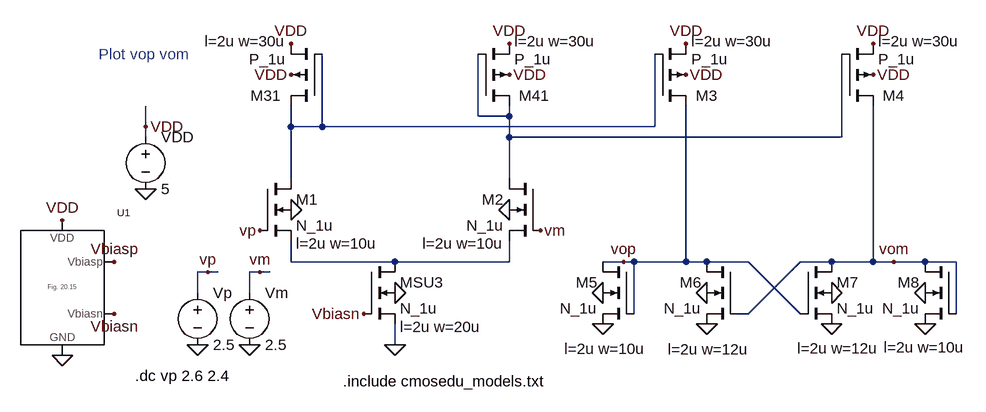
[diagram p0: schematic Fig27_7b.asc]
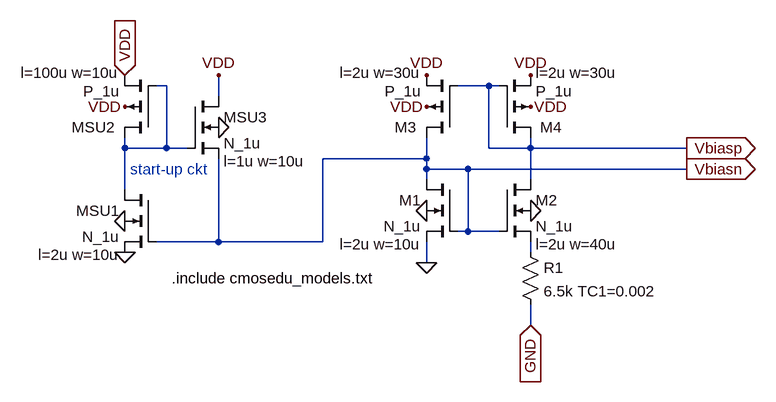
[diagram p1: sub-circuit fig_20_15.asc]
Fig27_7b.asc, the LTspice schematic file:
Version 4
SHEET 1 1928 680
WIRE 928 -80 928 -176
WIRE 976 -80 976 -96
WIRE 976 -80 928 -80
WIRE 416 -64 416 -96
WIRE 640 -64 640 -96
WIRE 688 -64 688 -176
WIRE 688 -64 640 -64
WIRE 1200 -64 1200 -176
WIRE 1200 -64 688 -64
WIRE 416 -48 416 -64
WIRE 976 -48 976 -80
WIRE 1488 -48 1488 -176
WIRE 1488 -48 976 -48
WIRE 640 16 640 -64
WIRE 976 16 976 -48
WIRE 640 144 640 112
WIRE 800 144 640 144
WIRE 976 144 976 112
WIRE 976 144 800 144
WIRE 1152 144 1120 144
WIRE 1168 144 1152 144
WIRE 1248 144 1248 -96
WIRE 1248 144 1168 144
WIRE 1280 144 1248 144
WIRE 1344 144 1280 144
WIRE 1472 144 1424 144
WIRE 1536 144 1536 -96
WIRE 1536 144 1472 144
WIRE 1568 144 1536 144
WIRE 1616 144 1568 144
WIRE 1664 144 1616 144
WIRE 512 160 496 160
WIRE 528 160 512 160
WIRE 592 160 576 160
WIRE 608 160 592 160
WIRE 496 192 496 160
WIRE 576 192 576 160
WIRE 1168 224 1168 144
WIRE 1344 224 1424 144
WIRE 1344 224 1328 224
WIRE 1424 224 1344 144
WIRE 1664 224 1664 144
WIRE 800 272 800 240
FLAG 416 32 0
FLAG 416 -64 VDD
FLAG 800 192 0
FLAG 640 -144 VDD
FLAG 976 -144 VDD
FLAG 288 80 VDD
FLAG 288 288 0
FLAG 368 144 Vbiasp
FLAG 368 224 Vbiasn
FLAG 800 272 0
FLAG 752 224 Vbiasn
FLAG 640 -192 VDD
FLAG 976 -192 VDD
FLAG 640 64 0
FLAG 976 64 0
FLAG 592 96 vp
FLAG 1024 96 vm
FLAG 496 272 0
FLAG 512 160 vp
FLAG 576 272 0
FLAG 592 160 vm
FLAG 1248 -144 VDD
FLAG 1248 -192 VDD
FLAG 1536 -144 VDD
FLAG 1536 -192 VDD
FLAG 1120 192 0
FLAG 1280 192 0
FLAG 1472 192 0
FLAG 1616 192 0
FLAG 1120 240 0
FLAG 1280 240 0
FLAG 1472 240 0
FLAG 1616 240 0
FLAG 1152 144 vop
FLAG 1568 144 vom
SYMBOL voltage 416 -64 R0
SYMATTR InstName VDD
SYMATTR Value 5
SYMBOL nmos4 752 144 R0
WINDOW 123 56 100 Left 2
SYMATTR Value2 l=2u w=20u
SYMATTR InstName MSU3
SYMATTR Value N_1u
SYMBOL pmos4 688 -96 R180
WINDOW 0 63 16 Left 2
WINDOW 123 56 100 Left 2
SYMATTR InstName M31
SYMATTR Value2 l=2u w=30u
SYMATTR Value P_1u
SYMBOL pmos4 928 -96 M180
WINDOW 0 63 16 Left 2
WINDOW 123 56 100 Left 2
SYMATTR InstName M41
SYMATTR Value2 l=2u w=30u
SYMATTR Value P_1u
SYMBOL nmos4 1024 16 M0
WINDOW 123 56 100 Left 2
SYMATTR Value2 l=2u w=10u
SYMATTR InstName M2
SYMATTR Value N_1u
SYMBOL nmos4 592 16 R0
WINDOW 123 56 100 Left 2
SYMATTR Value2 l=2u w=10u
SYMATTR InstName M1
SYMATTR Value N_1u
SYMBOL Fig_20_15 224 192 R0
SYMATTR InstName U1
SYMBOL voltage 496 176 R0
SYMATTR InstName Vp
SYMATTR Value 2.5
SYMBOL voltage 576 176 R0
SYMATTR InstName Vm
SYMATTR Value 2.5
SYMBOL pmos4 1200 -96 M180
WINDOW 0 63 16 Left 2
WINDOW 123 56 100 Left 2
SYMATTR InstName M3
SYMATTR Value2 l=2u w=30u
SYMATTR Value P_1u
SYMBOL pmos4 1488 -96 M180
WINDOW 0 63 16 Left 2
WINDOW 123 56 100 Left 2
SYMATTR InstName M4
SYMATTR Value2 l=2u w=30u
SYMATTR Value P_1u
SYMBOL nmos4 1168 144 M0
WINDOW 123 -18 134 Left 2
SYMATTR Value2 l=2u w=10u
SYMATTR InstName M5
SYMATTR Value N_1u
SYMBOL nmos4 1328 144 M0
WINDOW 123 -17 135 Left 2
SYMATTR Value2 l=2u w=12u
SYMATTR InstName M6
SYMATTR Value N_1u
SYMBOL nmos4 1424 144 R0
WINDOW 123 -5 133 Left 2
SYMATTR Value2 l=2u w=12u
SYMATTR InstName M7
SYMATTR Value N_1u
SYMBOL nmos4 1664 144 M0
WINDOW 123 -14 132 Left 2
SYMATTR Value2 l=2u w=10u
SYMATTR InstName M8
SYMATTR Value N_1u
TEXT 720 328 Left 2 !.include cmosedu_models.txt
TEXT 344 -176 Left 2 ;Plot vop vom
TEXT 400 320 Left 2 !.dc vp 2.6 2.4

fig_20_15.asc, the sub-circuit schematic file:
Version 4
SHEET 1 1556 680
WIRE 608 -80 592 -80
WIRE 1104 -80 1056 -80
WIRE 1120 -80 1104 -80
WIRE 688 -64 688 -96
WIRE 544 16 544 0
WIRE 608 16 608 -80
WIRE 608 16 544 16
WIRE 640 16 608 16
WIRE 1104 16 1104 -80
WIRE 1168 16 1168 0
WIRE 1168 16 1104 16
WIRE 1408 16 1168 16
WIRE 1008 32 1008 0
WIRE 1008 32 848 32
WIRE 1008 48 1008 32
WIRE 1072 48 1008 48
WIRE 1408 48 1072 48
WIRE 1008 64 1008 48
WIRE 1168 64 1168 16
WIRE 544 80 544 16
WIRE 1072 144 1072 48
WIRE 1072 144 1056 144
WIRE 1120 144 1072 144
WIRE 688 160 688 32
WIRE 688 160 592 160
WIRE 848 160 848 32
WIRE 848 160 688 160
WIRE 1168 176 1168 160
WIRE 1008 192 1008 160
WIRE 1168 288 1168 256
FLAG 544 -48 VDD
FLAG 544 128 0
FLAG 688 -16 0
FLAG 688 -96 VDD
FLAG 1008 -48 VDD
FLAG 1008 -96 VDD
FLAG 1168 -48 VDD
FLAG 1168 -96 VDD
FLAG 1008 192 0
FLAG 1008 112 0
FLAG 1168 112 0
FLAG 544 -96 VDD
IOPIN 544 -96 In
FLAG 544 176 0
FLAG 1408 16 Vbiasp
IOPIN 1408 16 Out
FLAG 1408 48 Vbiasn
IOPIN 1408 48 Out
FLAG 1168 288 GND
IOPIN 1168 288 In
SYMBOL pmos4 592 0 R180
WINDOW 0 63 16 Left 2
WINDOW 123 56 100 Left 2
SYMATTR InstName MSU2
SYMATTR Value2 l=100u w=10u
SYMATTR Value P_1u
SYMBOL nmos4 592 80 M0
WINDOW 123 56 100 Left 2
SYMATTR Value2 l=2u w=10u
SYMATTR InstName MSU1
SYMATTR Value N_1u
SYMBOL nmos4 640 -64 R0
WINDOW 123 56 100 Left 2
SYMATTR Value2 l=1u w=10u
SYMATTR InstName MSU3
SYMATTR Value N_1u
SYMBOL pmos4 1056 0 R180
WINDOW 0 63 16 Left 2
WINDOW 123 56 100 Left 2
SYMATTR InstName M3
SYMATTR Value2 l=2u w=30u
SYMATTR Value P_1u
SYMBOL pmos4 1120 0 M180
WINDOW 0 63 16 Left 2
WINDOW 123 56 100 Left 2
SYMATTR InstName M4
SYMATTR Value2 l=2u w=30u
SYMATTR Value P_1u
SYMBOL nmos4 1056 64 M0
WINDOW 123 56 100 Left 2
SYMATTR Value2 l=2u w=10u
SYMATTR InstName M1
SYMATTR Value N_1u
SYMBOL nmos4 1120 64 R0
WINDOW 123 56 100 Left 2
SYMATTR Value2 l=2u w=40u
SYMATTR InstName M2
SYMATTR Value N_1u
SYMBOL res 1152 160 R0
SYMATTR InstName R1
SYMATTR Value 6.5k TC1=0.002
TEXT 552 48 Left 2 ;start-up ckt
TEXT 616 216 Left 2 !.include cmosedu_models.txt

The netlist it stands for:
* Fig27_7b.asc
VDD VDD 0 5
MSU3 N003 Vbiasn 0 0 N_1u l=2u w=20u
M31 N002 N002 VDD VDD P_1u l=2u w=30u
M41 N001 N001 VDD VDD P_1u l=2u w=30u
M2 N001 vm N003 0 N_1u l=2u w=10u
M1 N002 vp N003 0 N_1u l=2u w=10u
XU1 Vbiasn Vbiasp VDD 0 fig_20_15
Vp vp 0 2.5
Vm vm 0 2.5
M3 vop N002 VDD VDD P_1u l=2u w=30u
M4 vom N001 VDD VDD P_1u l=2u w=30u
M5 vop vop 0 0 N_1u l=2u w=10u
M6 vop vom 0 0 N_1u l=2u w=12u
M7 vom vop 0 0 N_1u l=2u w=12u
M8 vom vom 0 0 N_1u l=2u w=10u

* block symbol definitions
.subckt fig_20_15 Vbiasn Vbiasp VDD GND
MSU2 N001 N001 VDD VDD P_1u l=100u w=10u
MSU1 N001 Vbiasn 0 0 N_1u l=2u w=10u
MSU3 VDD N001 Vbiasn 0 N_1u l=1u w=10u
M3 Vbiasn Vbiasp VDD VDD P_1u l=2u w=30u
M4 Vbiasp Vbiasp VDD VDD P_1u l=2u w=30u
M1 Vbiasn Vbiasn 0 0 N_1u l=2u w=10u
M2 Vbiasp Vbiasn N002 0 N_1u l=2u w=40u
R1 N002 GND 6.5k TC1=0.002
* start-up ckt
.include cmosedu_models.txt
.ends fig_20_15

.model NMOS NMOS
.model PMOS PMOS
.lib standard.mos
.include cmosedu_models.txt
* Plot vop vom
.dc vp 2.6 2.4
.backanno
.end